# Altium schematic sheet Flaps第三版_2023-07-31.schdoc
size 314 x 219 mm
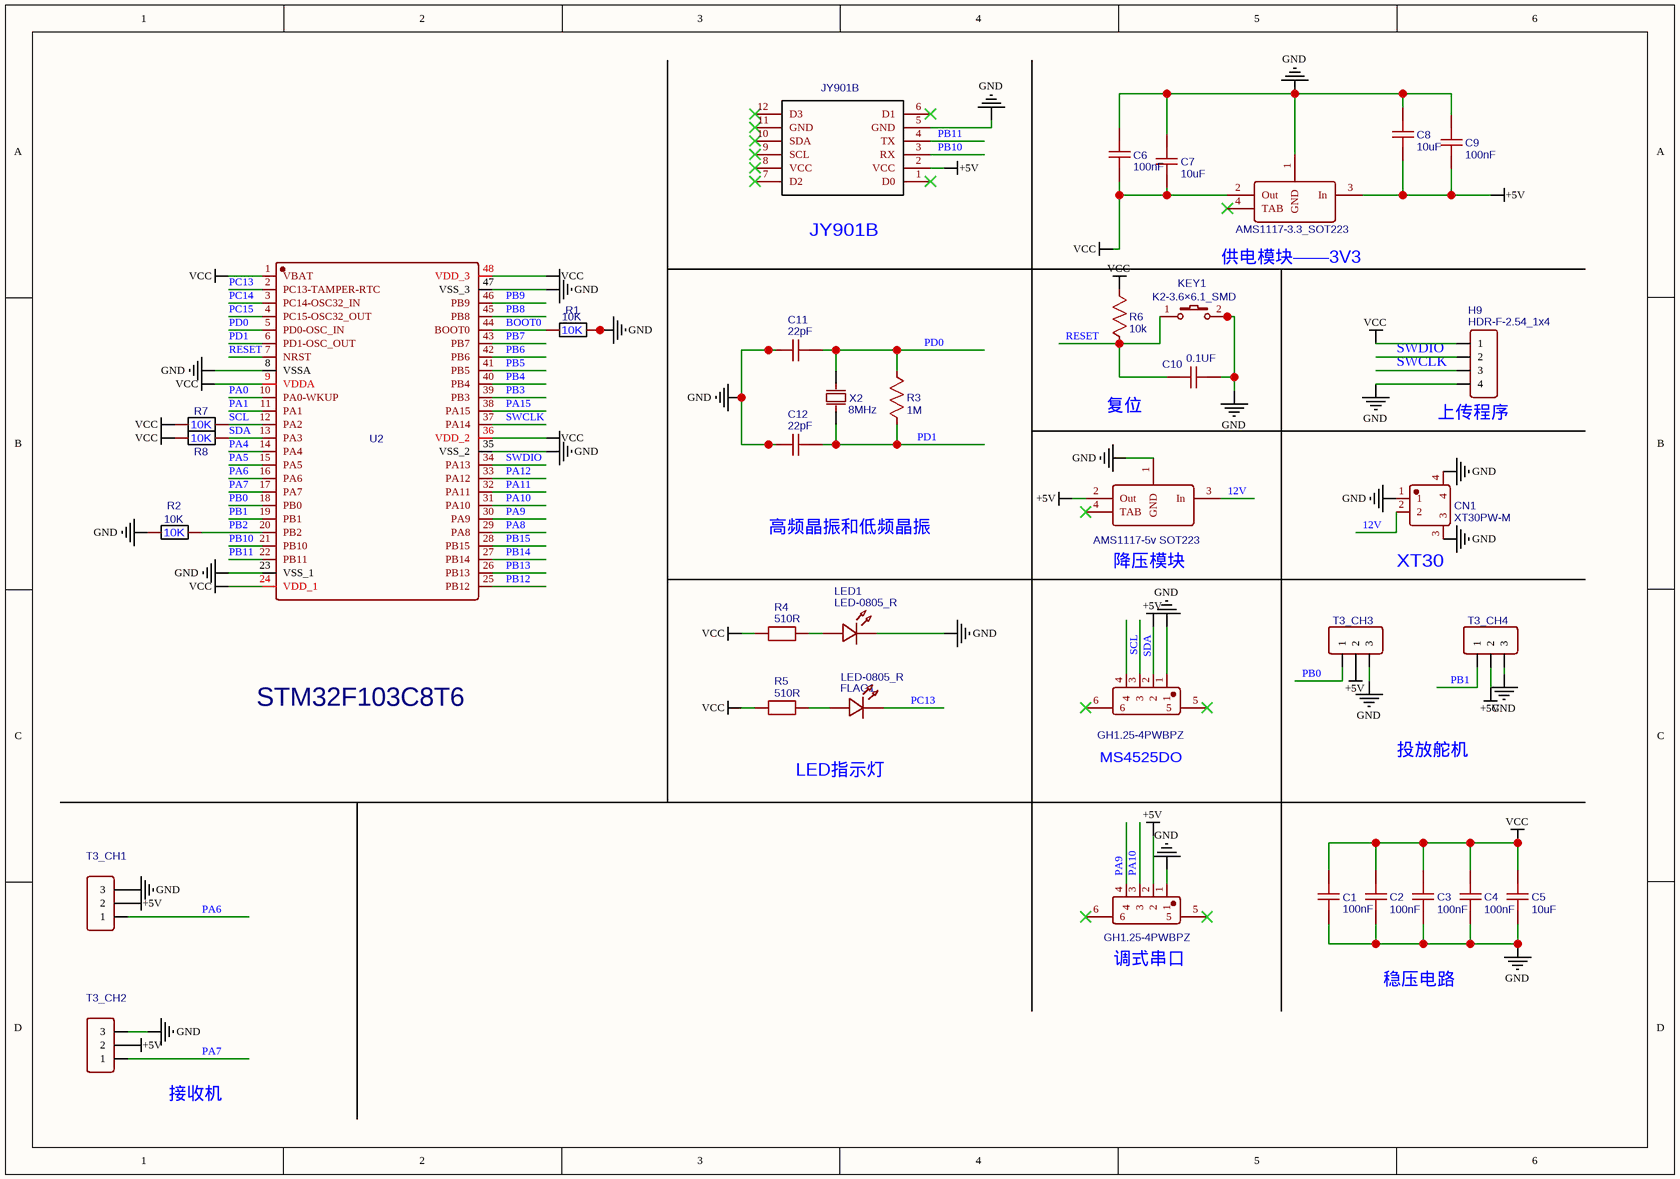
[diagram p0: Flaps第三版_2023-07-31.schdoc]

## Parts
C1  100nF  [C0603]
C2  100nF  [C0603]
C3  100nF  [C0603]
C4  100nF  [C0603]
C5  10uF  [C0603]
C6  100nF  [C0603]
C7  10uF  [C0603]
C8  10uF  [C0603]
C9  100nF  [C0603]
C10  0.1UF  [C0603]
C11  22pF  [C0603]
C12  22pF  [C0603]
CN1  XT30PW-M  [CONN-TH_XT30PW-M]
FLAG1  LED-0805_R  [LED0805_RED]
H9  HDR-F-2.54_1x4  [HDR-F-2.54_1X4]
KEY1  K2-3.6×6.1_SMD  [KEY-SMD_2P-L6.2-W3.6-LS8.0]
LED1  LED-0805_R  [LED0805_RED]
R1  10K  [R0603]
R2  10K  [R0603]
R3  1M  [R0603]
R4  510R  [R0603]
R5  510R  [R0603]
R6  10k  [R0603]
R7  10K  [R0603]  (value not drawn)
R8  10K  [R0603]  (value not drawn)
T3_CH1  HDR-F-2.54_1x3  [HDR-F-2.54_1X3]  (value not drawn)
T3_CH2  HDR-F-2.54_1x3  [HDR-F-2.54_1X3]  (value not drawn)
T3_CH3  HDR-F-2.54_1x3  [HDR-F-2.54_1X3]  (value not drawn)
T3_CH4  HDR-F-2.54_1x3  [HDR-F-2.54_1X3]  (value not drawn)
U1  AMS1117-3.3_SOT223  [SOT-223-4_L6.5-W3.5-P2.30-LS7.0-BR]
U2  STM32F103C8T6  [LQFP-48_L7.0-W7.0-P0.50-LS9.0-BL]
U3  AMS1117-5v SOT223  [AMS1117-5V]
U4  GH1.25-4PWBPZ  [CONN-SMD_GH1.25-4PWBPZ]
U5  GH1.25-4PWBPZ  [CONN-SMD_GH1.25-4PWBPZ]
U9  JY901B  [JY901B 插针]
X2  8MHz  [HC-49S_L11.4-W4.8]

## Nets
+5V: C8.2 C9.2 T3_CH1.2 T3_CH2.2 T3_CH3.2 T3_CH4.2 U1.3(In) U3.2(Out) U4.2 U5.2 U9.2(VCC)
GND: C1.1 C2.1 C3.1 C4.1 C5.1 C6.1 C7.1 C8.1 C9.1 C10.2 C11.1 C12.1 CN1.1 CN1.3 CN1.4 H9.4 KEY1.2 LED1.2 R1.2 R2.1 T3_CH1.3 T3_CH2.3 T3_CH3.3 T3_CH4.3 U1.1(GND) U2.8(VSSA) U2.23(VSS_1) U2.35(VSS_2) U2.47(VSS_3) U3.1(GND) U4.1 U5.1 U9.5(GND)
VCC: C1.2 C2.2 C3.2 C4.2 C5.2 C6.2 C7.2 H9.1 R4.1 R5.1 R6.2 R7.1 R8.1 U1.2(Out) U2.1(VBAT) U2.9(VDDA) U2.24(VDD_1) U2.36(VDD_2) U2.48(VDD_3)
12V: CN1.2 U3.3(In)
BOOT0: R1.1 U2.44(BOOT0)
PA0: U2.10(PA0-WKUP)
PA1: U2.11(PA1)
PA4: U2.14(PA4)
PA5: U2.15(PA5)
PA6: T3_CH1.1 U2.16(PA6)
PA7: T3_CH2.1 U2.17(PA7)
PA8: U2.29(PA8)
PA9: U2.30(PA9) U5.4
PA10: U2.31(PA10) U5.3
PA11: U2.32(PA11)
PA12: U2.33(PA12)
PA15: U2.38(PA15)
PB0: T3_CH3.1 U2.18(PB0)
PB1: T3_CH4.1 U2.19(PB1)
PB2: R2.2 U2.20(PB2)
PB3: U2.39(PB3)
PB4: U2.40(PB4)
PB5: U2.41(PB5)
PB6: U2.42(PB6)
PB7: U2.43(PB7)
PB8: U2.45(PB8)
PB9: U2.46(PB9)
PB10: U2.21(PB10) U9.3(RX)
PB11: U2.22(PB11) U9.4(TX)
PB12: U2.25(PB12)
PB13: U2.26(PB13)
PB14: U2.27(PB14)
PB15: U2.28(PB15)
PC13: FLAG1.2 U2.2(PC13-TAMPER-RTC)
PC14: U2.3(PC14-OSC32_IN)
PC15: U2.4(PC15-OSC32_OUT)
PD0: C11.2 R3.2 U2.5(PD0-OSC_IN) X2.2(OSC2)
PD1: C12.2 R3.1 U2.6(PD1-OSC_OUT) X2.1(OSC1)
RESET: C10.1 KEY1.1 R6.1 U2.7(NRST)
SCL: R7.2 U2.12(PA2) U4.4
SDA: R8.2 U2.13(PA3) U4.3
SWCLK: H9.3 U2.37(PA14)
SWDIO: H9.2 U2.34(PA13)
NetFLAG1_1: FLAG1.1 R5.2
NetLED1_1: LED1.1 R4.2

Not connected (* = marked no-connect by the designer): U1 4(TAB)*; U3 4(TAB)*; U4 5* 6*; U5 5* 6*; U9 1(D0)* 6(D1)* 7(D2)* 8(VCC)* 9(SCL)* 10(SDA)* 11(GND)* 12(D3)*

## Notes on the sheet
- 供电模块——3V3
- 复位
- (near H9) 上传程序
- 高频晶振和低频晶振
- (near U3) 降压模块
- (near CN1) XT30
- LED指示灯
- (near U4) MS4525DO
- 投放舵机
- (near U5) 调式串口
- 稳压电路
- 接收机

## Library data of the parts
C1-C4 = 100nF: nameAlias: Value(F); Contributor: LCEDA_Lib; spicePre: C; spiceSymbolName: C_0603_US
C5 = 10uF: nameAlias: Value(F); Contributor: LCEDA_Lib; spicePre: C; spiceSymbolName: C_0603_US
C6 C9 = 100nF: Manufacturer: SAMSUNG; Manufacturer Part: CL10B104KC8NNNC; nameAlias: Capacitance; SMT Type: Extend; Supplier: LCSC; Supplier Part: C15725; LCSC Assembly: Yes; spicePre: C; spiceSymbolName: CL10B104KC8NNNC
C7 C8 = 10uF: Manufacturer: Taiyo Yuden; Manufacturer Part: EMK316AB7106KL-T; nameAlias: Capacitance; Contributor: LCSC; Supplier: LCSC; Supplier Part: C319199; spicePre: C; spiceSymbolName: EMK316AB7106KL-T
C10 = 0.1UF: nameAlias: Value(F); Contributor: LCEDA_Lib; spicePre: C; spiceSymbolName: C_0603_US
C11 C12 = 22pF: nameAlias: Value(F); Contributor: LCEDA_Lib; spicePre: C; spiceSymbolName: C_0603_US
CN1 = XT30PW-M: Manufacturer: Changzhou Amass Elec; Contributor: LCSC; Supplier: LCSC; Supplier Part: C431092; Manufacturer Part: XT30PW-M; JLCPCB Part Class: Extended Part; spicePre: C; spiceSymbolName: XT30PW-M
FLAG1 LED1 = LED-0805_R: Manufacturer: EVERLIGHT(台湾亿光); Manufacturer Part: 17-21SURC/S530-A3/TR8; Contributor: LCEDA_Lib; Supplier Part: C72037; spicePre: L; spiceSymbolName: LED-0805_R
H9 = HDR-F-2.54_1x4: Contributor: LCEDA_Lib; Supplier Part: C225501; Supplier: LCSC; spicePre: H; spiceSymbolName: HDR-F-2.54_1x4
KEY1 = K2-3.6×6.1_SMD: Manufacturer Part: K2-1107ST-A4SW-06; Contributor: LCEDA_Lib; 制造商: 韩国韩荣; Supplier Part: C118141; Supplier: LCSC; spicePre: K; spiceSymbolName: K2-3.6×6.1_SMD
R1 R2 R7 R8 = 10K: Contributor: caocunzhangxiaobai; Supplier: LCSC; spicePre: U; spiceSymbolName: 10K电阻R0603
R3 = 1M: nameAlias: Value(Ω); Contributor: LCEDA_Lib; spicePre: R; spiceSymbolName: R_0603_US
R4 R5 = 510R: nameAlias: Value(Ω); Contributor: LCEDA_Lib; spicePre: R; spiceSymbolName: R_0603_EU
R6 = 10k: nameAlias: Value(Ω); Contributor: LCEDA_Lib; spicePre: R; spiceSymbolName: R_0603_US
T3_CH1-T3_CH4 = HDR-F-2.54_1x3: Contributor: LCEDA_Lib; Supplier Part: C146690; Supplier: LCSC; spicePre: H; spiceSymbolName: HDR-F-2.54_1x3
U1 = AMS1117-3.3_SOT223: Manufacturer: SK; Contributor: LCSC; SMT Type: Extend; Supplier: LCSC; Supplier Part: C165482; Manufacturer Part: AMS1117-3.3; LCSC Assembly: Yes; spicePre: U; spiceSymbolName: AMS1117-3.3_C165482
U2 = STM32F103C8T6: Manufacturer: STMicroelectronics; SMT Type: Basic; timeStamp: 1455028086; Supplier: LCSC; Manufacturer Part: STM32F103C8T6; LCSC Assembly: Yes; image: //image.lceda.cn/szlcsc/C8734.jpg; Supplier Part: C8734; spicePre: U; spiceSymbolName: STM32F103C8T6
U3 = AMS1117-5v SOT223: Manufacturer: SK; Manufacturer Part: AMS1117-3.3; Contributor: LCSC; SMT Type: Extend; Supplier: LCSC; Supplier Part: C165482; LCSC Assembly: Yes; spicePre: U; spiceSymbolName: AMS1117-3.3_C165482
U4 U5 = GH1.25-4PWBPZ: Manufacturer: BOOMELE(博穆精密); Contributor: LCSC; Supplier: LCSC; Supplier Part: C2829253; Manufacturer Part: GH1.25-4PWBPZ; JLCPCB Part Class: Extended Part; spicePre: U; spiceSymbolName: GH1.25-4PWBPZ
U9 = JY901B: Contributor: 230W; Package Display: No; Supplier: WT; spicePre: U; spiceSymbolName: JY901B
X2 = 8MHz: Manufacturer: HOSONIC; Manufacturer Part: ESB8.00000F20E22; nameAlias: Frequency; Supplier: LCSC; Supplier Part: C99135; spicePre: X; spiceSymbolName: ESB8.00000F20E22